# Altium schematic sheet MCU&外设SCH.SchDoc: STM32F103C8及其外设电路
size 304 x 215 mm; Author: 许皓阳 15电4; DrawnBy: Staok; Revision: 3.14
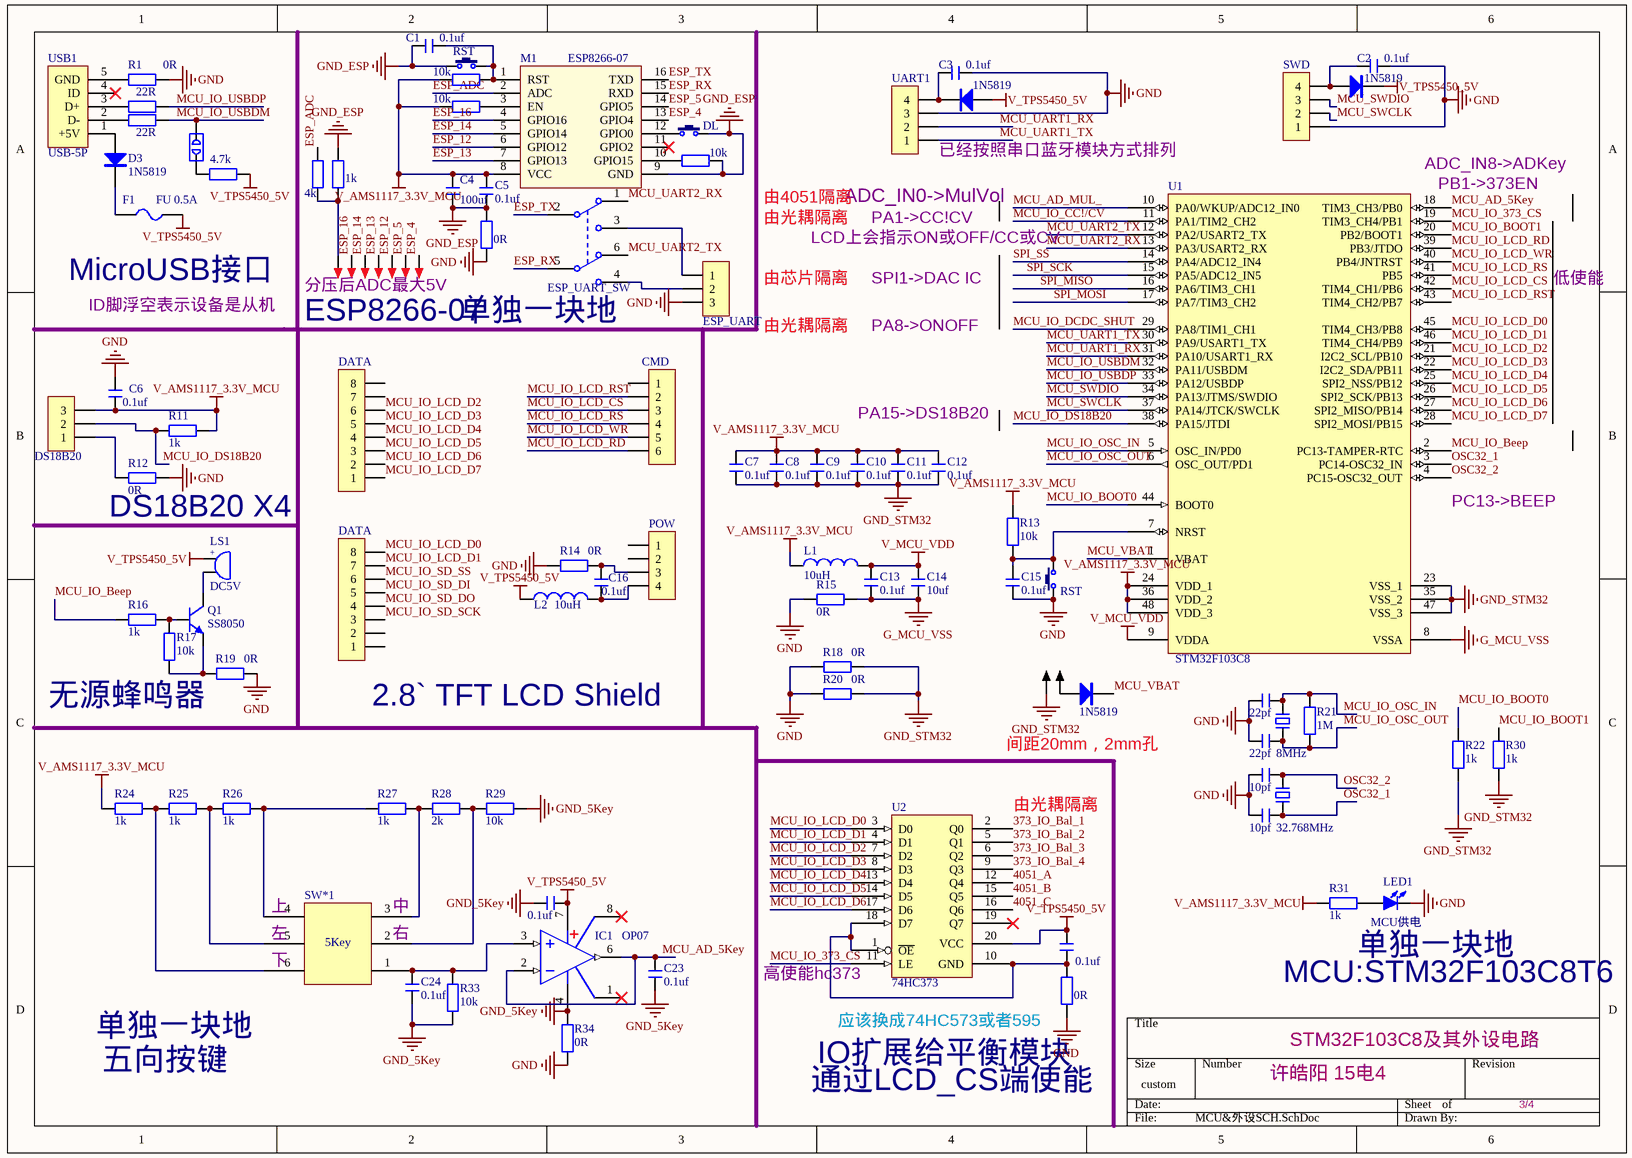
[diagram p0: MCU&外设SCH.SchDoc]

## Parts
*.  CS  [HDR2.54-LI-1P]  (value not drawn)
*..  CS  [HDR2.54-LI-1P]  (value not drawn)
C1  0.1uf  [C 0805_M]
C2  0.1uf  [C 0805_M]
C3  0.1uf  [C 0805_M]
C4  100uf  [CD D(7343)]
C5  0.1uf  [C 0805_M]
C6  0.1uf  [C 0805_M]
C7  0.1uf  [C 0805_M]
C8  0.1uf  [C 0805_M]
C9  0.1uf  [C 0805_M]
C10  0.1uf  [C 0805_M]
C11  0.1uf  [C 0805_M]
C12  0.1uf  [C 0805_M]
C13  0.1uf  [C 0805_M]
C14  10uf  [C 0805_M]
C15  0.1uf  [C 0805_M]
C16  0.1uf  [C 0805_M]
C17  22pf  [C 0805_M]
C18  22pf  [C 0805_M]
C19  10pf  [C 0805_M]
C20  10pf  [C 0805_M]
C21  0.1uf  [C 0805_M]
C22  0.1uf  [C 0805_M]
C23  0.1uf  [C 0805_M]
C24  0.1uf  [C 0805_M]
D1  1N5819  [SOD-123]
D2  1N5819  [SOD-123]
D2.  1N5819  [SOD-123]
D3  1N5819  [SOD-123]
DE1  1  [DEBUG_B]  (value not drawn)
F1  FU 0.5A  [FU 1206]
IC1  OP07  [SOP8_N]
JP1  SWD  [HDR2.54-LI-4P]
JP2  UART1  [HDR2.54-LI-4P]
JP3  ESP_UART  [HDR2.54-LI-3P]
JP4  DS18B20  [HDR2.54-LI-3P]
JP5  CMD  [HDR2.54-M-LI-6P]
JP6  DATA  [HDR2.54-M-LI-8P]
JP6.  DATA  [HDR2.54-M-LI-8P]
JP7  POW  [HDR2.54-M-LI-4P]
L1  10uH  [L 0805_M]
L2  10uH  [L 0805_M]
LED1  MCU供电  [LED 0805G]
LS1  DC5V  [BEEP 7.6X12X7.5]
M1  ESP8266-07  [ESP-07]
Q1  SS8050  [SOT23-3M]
R1  0R  [R 0805_M]
R2  10k  [R 0805_M]
R3  22R  [R 0805_M]
R4  10k  [R 0805_M]
R5  22R  [R 0805_M]
R6  10k  [R 0805_M]
R7  4.7k  [R 0805_M]
R8  4k  [R 0805_M]
R9  1k  [R 0805_M]
R10  0R  [R 0805_M]
R11  1k  [R 0805_M]
R12  0R  [R 0805_M]
R13  10k  [R 0805_M]
R14  0R  [R 0805_M]
R15  0R  [R 0805_M]
R16  1k  [R 0805_M]
R17  10k  [R 0805_M]
R18  0R  [R 0805_M]
R19  0R  [R 0805_M]
R20  0R  [R 0805_M]
R21  1M  [R 0805_M]
R22  1k  [R 0805_M]
R24  1k  [R 0805_M]
R25  1k  [R 0805_M]
R26  1k  [R 0805_M]
R27  1k  [R 0805_M]
R28  2k  [R 0805_M]
R29  10k  [R 0805_M]
R30  1k  [R 0805_M]
R31  1k  [R 0805_M]
R32  0R  [R 0805_M]
R33  10k  [R 0805_M]
R34  0R  [R 0805_M]
S.  ESP_UART_SW  [SK-22D02]
SW1  RST  [TSW SMD-3*6*2.5]
SW2  DL  [TSW SMD-3*6*2.5]
SW3  RST  [TSW SMD-3*6*2.5]
SW*1  5Key  [TSW 10x10x9-5Key-LS]
TP1  ..  [TEST 1]  (value not drawn)
TP2  ..  [TEST 1]  (value not drawn)
TP3  ..  [TEST 1]  (value not drawn)
TP4  ..  [TEST 1]  (value not drawn)
TP5  ..  [TEST 1]  (value not drawn)
TP6  ..  [TEST 1]  (value not drawn)
TP7  ..  [TEST 1]  (value not drawn)
U1  STM32F103C8  [LQFP48 7X7_N]
U2  74HC373  [SOP20_N]
USB1  USB-5P  [USB-MICRO_E]
X1  8MHz  [OSC HC-49S]
X2  32.768MHz  [OSC-3x8-LI]

## Nets
G_MCU_VSS: C13.1 C14.1 R15.1 U1.8(VSSA)
GND: C2.2 C3.2 C6.2 C15.1 C17.2 C18.2 C19.2 C20.2 JP1.1 JP2.3 JP3.3 LED1.2(K) R1.1 R10.2 R12.1 R14.1 R15.2 R18.1 R19.2 R20.1 R32.2 R34.2 SW3.1
GND_5Key: C21.1 C23.1 C24.1 IC1.4(V-) R29.1 R33.1 R34.1
GND_ESP: C1.2 C4.2 C5.1 M1.9(GND) R6.2 R9.2 R10.1 SW1.1 SW2.2
GND_STM32: *..1 C7.1 C8.1 C9.1 C10.1 C11.1 C12.1 R18.2 R20.2 R22.1 R30.1 U1.23(VSS_1) U1.35(VSS_2) U1.47(VSS_3)
V_AMS1117_3.3V_MCU: C4.1 C5.2 C6.1 C7.2 C8.2 C9.2 C10.2 C11.2 C12.2 JP4.3 L1.1 M1.8(VCC) R2.1 R4.1 R11.2 R13.2 R24.2 R31.1 U1.24(VDD_1) U1.36(VDD_2) U1.48(VDD_3)
V_MCU_VDD: C13.2 C14.2 L1.2 U1.9(VDDA)
V_TPS5450_5V: C21.2 C22.1 D1.2(K) D2.1(A) F1.2 IC1.7(V+) L2.1 LS1.1 R7.2 U2.20(VCC)
373_IO_Bal_1: U2.2(Q0)
373_IO_Bal_2: U2.5(Q1)
373_IO_Bal_3: U2.6(Q2)
373_IO_Bal_4: U2.9(Q3)
4051_A: U2.12(Q4)
4051_B: U2.15(Q5)
4051_C: U2.16(Q6)
ESP_4: M1.13(GPIO4) TP7.1
ESP_5: M1.14(GPIO5) TP6.1
ESP_12: M1.6(GPIO12) TP5.1
ESP_13: M1.7(GPIO13) TP4.1
ESP_14: M1.5(GPIO14) TP3.1
ESP_16: M1.4(GPIO16) TP2.1
ESP_ADC: M1.2(ADC) R8.2
ESP_RX: M1.15(RXD) S..5
ESP_TX: M1.16(TXD) S..2
MCU_AD_5Key: C23.2 IC1.2(IN-) IC1.6(OUT) U1.18(TIM3_CH3/PB0)
MCU_AD_MUL_: U1.10(PA0/WKUP/ADC12_IN0)
MCU_IO_373_CS: U1.19(TIM3_CH4/PB1) U2.11(LE)
MCU_IO_Beep: R16.2 U1.2(PC13-TAMPER-RTC)
MCU_IO_BOOT0: R22.2 U1.44(BOOT0)
MCU_IO_BOOT1: R30.2 U1.20(PB2/BOOT1)
MCU_IO_CC!/CV: U1.11(PA1/TIM2_CH2)
MCU_IO_DCDC_SHUT: U1.29(PA8/TIM1_CH1)
MCU_IO_DS18B20: JP4.2 R11.1 U1.38(PA15/JTDI)
MCU_IO_LCD_CS: JP5.3 U1.42(TIM4_CH1/PB6)
MCU_IO_LCD_D0: JP6..8 U1.45(TIM4_CH3/PB8) U2.3(D0)
MCU_IO_LCD_D1: JP6..7 U1.46(TIM4_CH4/PB9) U2.4(D1)
MCU_IO_LCD_D2: JP6.6 U1.21(I2C2_SCL/PB10) U2.7(D2)
MCU_IO_LCD_D3: JP6.5 U1.22(I2C2_SDA/PB11) U2.8(D3)
MCU_IO_LCD_D4: JP6.4 U1.25(SPI2_NSS/PB12) U2.13(D4)
MCU_IO_LCD_D5: JP6.3 U1.26(SPI2_SCK/PB13) U2.14(D5)
MCU_IO_LCD_D6: JP6.2 U1.27(SPI2_MISO/PB14) U2.17(D6)
MCU_IO_LCD_D7: JP6.1 U1.28(SPI2_MOSI/PB15)
MCU_IO_LCD_RD: JP5.6 U1.39(PB3/JTDO)
MCU_IO_LCD_RS: JP5.4 U1.41(PB5)
MCU_IO_LCD_RST: JP5.2 U1.43(TIM4_CH2/PB7)
MCU_IO_LCD_WR: JP5.5 U1.40(PB4/JNTRST)
MCU_IO_OSC_IN: C17.1 R21.1 U1.5(OSC_IN/PD0) X1.2
MCU_IO_OSC_OUT: C18.1 R21.2 U1.6(OSC_OUT/PD1) X1.1
MCU_IO_SD_DI: JP6..5
MCU_IO_SD_DO: JP6..4
MCU_IO_SD_SCK: JP6..3
MCU_IO_SD_SS: JP6..6
MCU_IO_USBDM: DE1.2 R5.1 U1.32(PA11/USBDM)
MCU_IO_USBDP: R3.1 U1.33(PA12/USBDP)
MCU_SWCLK: JP1.2 U1.37(PA14/JTCK/SWCLK)
MCU_SWDIO: JP1.3 U1.34(PA13/JTMS/SWDIO)
MCU_UART1_RX: JP2.2 U1.31(PA10/USART1_RX)
MCU_UART1_TX: JP2.1 U1.30(PA9/USART1_TX)
MCU_UART2_RX: S..1 U1.13(PA3/USART2_RX)
MCU_UART2_TX: S..6 U1.12(PA2/USART2_TX)
MCU_VBAT: D2..2(K) U1.1(VBAT)
OSC32_1: C20.1 U1.3(PC14-OSC32_IN) X2.1
OSC32_2: C19.1 U1.4(PC15-OSC32_OUT) X2.2
SPI_MISO: U1.16(PA6/TIM3_CH1)
SPI_MOSI: U1.17(PA7/TIM3_CH2)
SPI_SCK: U1.15(PA5/ADC12_IN5)
SPI_SS: U1.14(PA4/ADC12_IN4)
Net*.._1: *...1 D2..1(A)
NetC1_1: C1.1 M1.1(RST) R2.2 SW1.2
NetC2_1: C2.1 D1.1(A) JP1.4
NetC3_1: C3.1 D2.2(K) JP2.4
NetC15_2: C15.2 R13.1 SW3.2 U1.7(NRST)
NetC16_1: C16.1 JP7.4 L2.2
NetC16_2: C16.2 JP7.3 R14.2
NetC22_2: C22.2 R32.1 U2.1(~{OE}) U2.10(GND) U2.18(D7)
NetC24_2: C24.2 IC1.3(IN+) R33.2 SW*1.1
NetD3_1: D3.1(A) USB1.1(+5V)
NetD3_2: D3.2(K) F1.1
NetDE1_1: DE1.1 R7.1
NetJP3_1: JP3.1 S..3
NetJP3_2: JP3.2 S..4
NetJP4_1: JP4.1 R12.2
NetLED1_1: LED1.1(A) R31.2
NetLS1_2: LS1.2 Q1.3(C)
NetM1_3: M1.3(EN) R4.2
NetM1_10: M1.10(GPIO15) R6.1
NetM1_12: M1.12(GPIO0) SW2.1
NetQ1_1: Q1.1(B) R16.1 R17.1
NetQ1_2: Q1.2(E) R17.2 R19.1
NetR1_2: R1.2 USB1.5(GND)
NetR3_2: R3.2 USB1.3(D+)
NetR5_2: R5.2 USB1.2(D-)
NetR8_1: R8.1 R9.1 TP1.1
NetR24_1: R24.1 R25.2 SW*1.6
NetR25_1: R25.1 R26.2 SW*1.5
NetR26_1: R26.1 R27.2 SW*1.4
NetR27_1: R27.1 R28.2 SW*1.3
NetR28_1: R28.1 R29.2 SW*1.2

Not connected (* = marked no-connect by the designer): IC1 1* 8*; JP5 1; JP6 7 8; JP6. 1 2; JP7 1 2; M1 11(GPIO2)*; U2 19(Q7)*; USB1 4(ID)*

## Notes on the sheet
- (near JP2) 已经按照串口蓝牙模块方式排列
- 由4051隔离
- 由光耦隔离
- (near JP2) ADC_IN0->MulVol
- PA1->CC!CV
- (near U1) ADC_IN8->ADKey
- (near U1) PB1->373EN
- (near F1) MicroUSB接口
- 分压后ADC最大5V
- 由芯片隔离
- LCD上会指示ON或OFF/CC或CV
- SPI1->DAC IC
- 低使能
- ID脚浮空表示设备是从机
- ESP8266-07
- 单独一块地
- PA8->ONOFF
- PA15->DS18B20
- (near U1) PC13->BEEP
- (near R12) DS18B20 X4
- 无源蜂鸣器
- (near JP6.) 2.8` TFT LCD Shield
- 间距20mm，2mm孔
- (near U2) 由光耦隔离
- (near SW*1) 上
- (near SW*1) 中
- (near SW*1) 左
- (near SW*1) 下
- (near SW*1) 右
- 高使能hc373
- (near U2) 应该换成74HC573或者595
- MCU:STM32F103C8T6
- 五向按键
- 通过LCD_CS端使能
- IO扩展给平衡模块
- 3/4
- (in symbol BEEP) +

## Library data of the parts
*. *.. = CS: 探针焊盘; 版权归属: 源创客; BOM名称: 探针焊盘; 学习资源: www.ooocke.com
C1-C24 = C: 无极性贴片电容; 版权归属: 源创客; BOM名称: 无极性贴片电容; 学习资源: www.ooocke.com
D1 D2 D2. D3 = 1N5819: 肖特基二极管; 版权归属: 源创客; 属性: 40V/2A; BOM名称: 肖特基二极管; 学习资源: www.ooocke.com
DE1 = DEBUG: 调试断点焊盘; 版权归属: 源创客; BOM名称: 调试断点焊盘; 学习资源: www.ooocke.com
F1 = FU: 贴片保险丝; 版权归属: 源创客; BOM名称: 贴片保险丝; 学习资源: www.ooocke.com
IC1 = OP07: 单路精密运放; 版权归属: 源创客; BOM名称: 单路精密运放; 学习资源: www.ooocke.com
JP1 JP2 JP7 = Header 4: 4P接插件; 版权归属: 源创客; BOM名称: 4P接插件; 学习资源: www.ooocke.com
JP3 JP4 = Header 3: 3P接插件; 版权归属: 源创客; BOM名称: 3P接插件; 学习资源: www.ooocke.com
JP5 = Header 6: 6P接插件; 版权归属: 源创客; BOM名称: 6P接插件; 学习资源: www.ooocke.com
JP6 JP6. = Header 8: 8P接插件; 版权归属: 源创客; BOM名称: 8P接插件; 学习资源: www.ooocke.com
L1 L2 = L: 小功率贴片电感; 版权归属: 源创客; BOM名称: 小功率贴片电感; 学习资源: www.ooocke.com
LED1 = LED-SMD: 贴片LED; 版权归属: 源创客; BOM名称: 贴片LED; 学习资源: www.ooocke.com
LS1 = BEEP: 蜂鸣器; 版权归属: 源创客; BOM名称: 蜂鸣器; 学习资源: www.ooocke.com
M1 = ESP8266-07: 串口 WIFI模块，ESP-07; BOM名称: WIFI模块; 版权归属: 源创客; 学习资源: www.ooocke.com
Q1 = 8050-SMD: 高频放大-NPN型; 版权归属: 源创客; 属性: 40V 1.5A 1W 100MHZ; BOM名称: 高频放大-NPN型; 学习资源: www.ooocke.com
R1-R22 R24-R34 = R: 贴片电阻; 版权归属: 源创客; BOM名称: 贴片电阻; 学习资源: www.ooocke.com
S. = SSW-2P: 2路波动开关; BOM名称: 波动开关; 版权归属: 源创客; 学习资源: www.ooocke.com
SW1-SW3 = TSW 3x6: 3x6轻触开关; 版权归属: 源创客; BOM名称: 3x6轻触开关; 学习资源: www.ooocke.com
SW*1 = 6
TP1-TP7 = TEST: 测试点; 版权归属: 源创客; BOM名称: 测试点; 学习资源: www.ooocke.com
U1 = STM32F103C8: Flaah:64/RAM:20/IO:36; BOM名称: 32位STM单片机; 版权归属: 源创客; 学习资源: www.ooocke.com
USB1 = USB-5P: 微型USB母座; 版权归属: 源创客; BOM名称: 微型USB母座; 学习资源: www.ooocke.com
X1 X2 = XTAL-2P: 2脚无源脚晶振; 版权归属: 源创客; 负载电容: CL20pF; BOM名称: 2脚无源脚晶振; 学习资源: www.ooocke.com